# EAGLE design 3d_control (EAGLE 8.3.2)
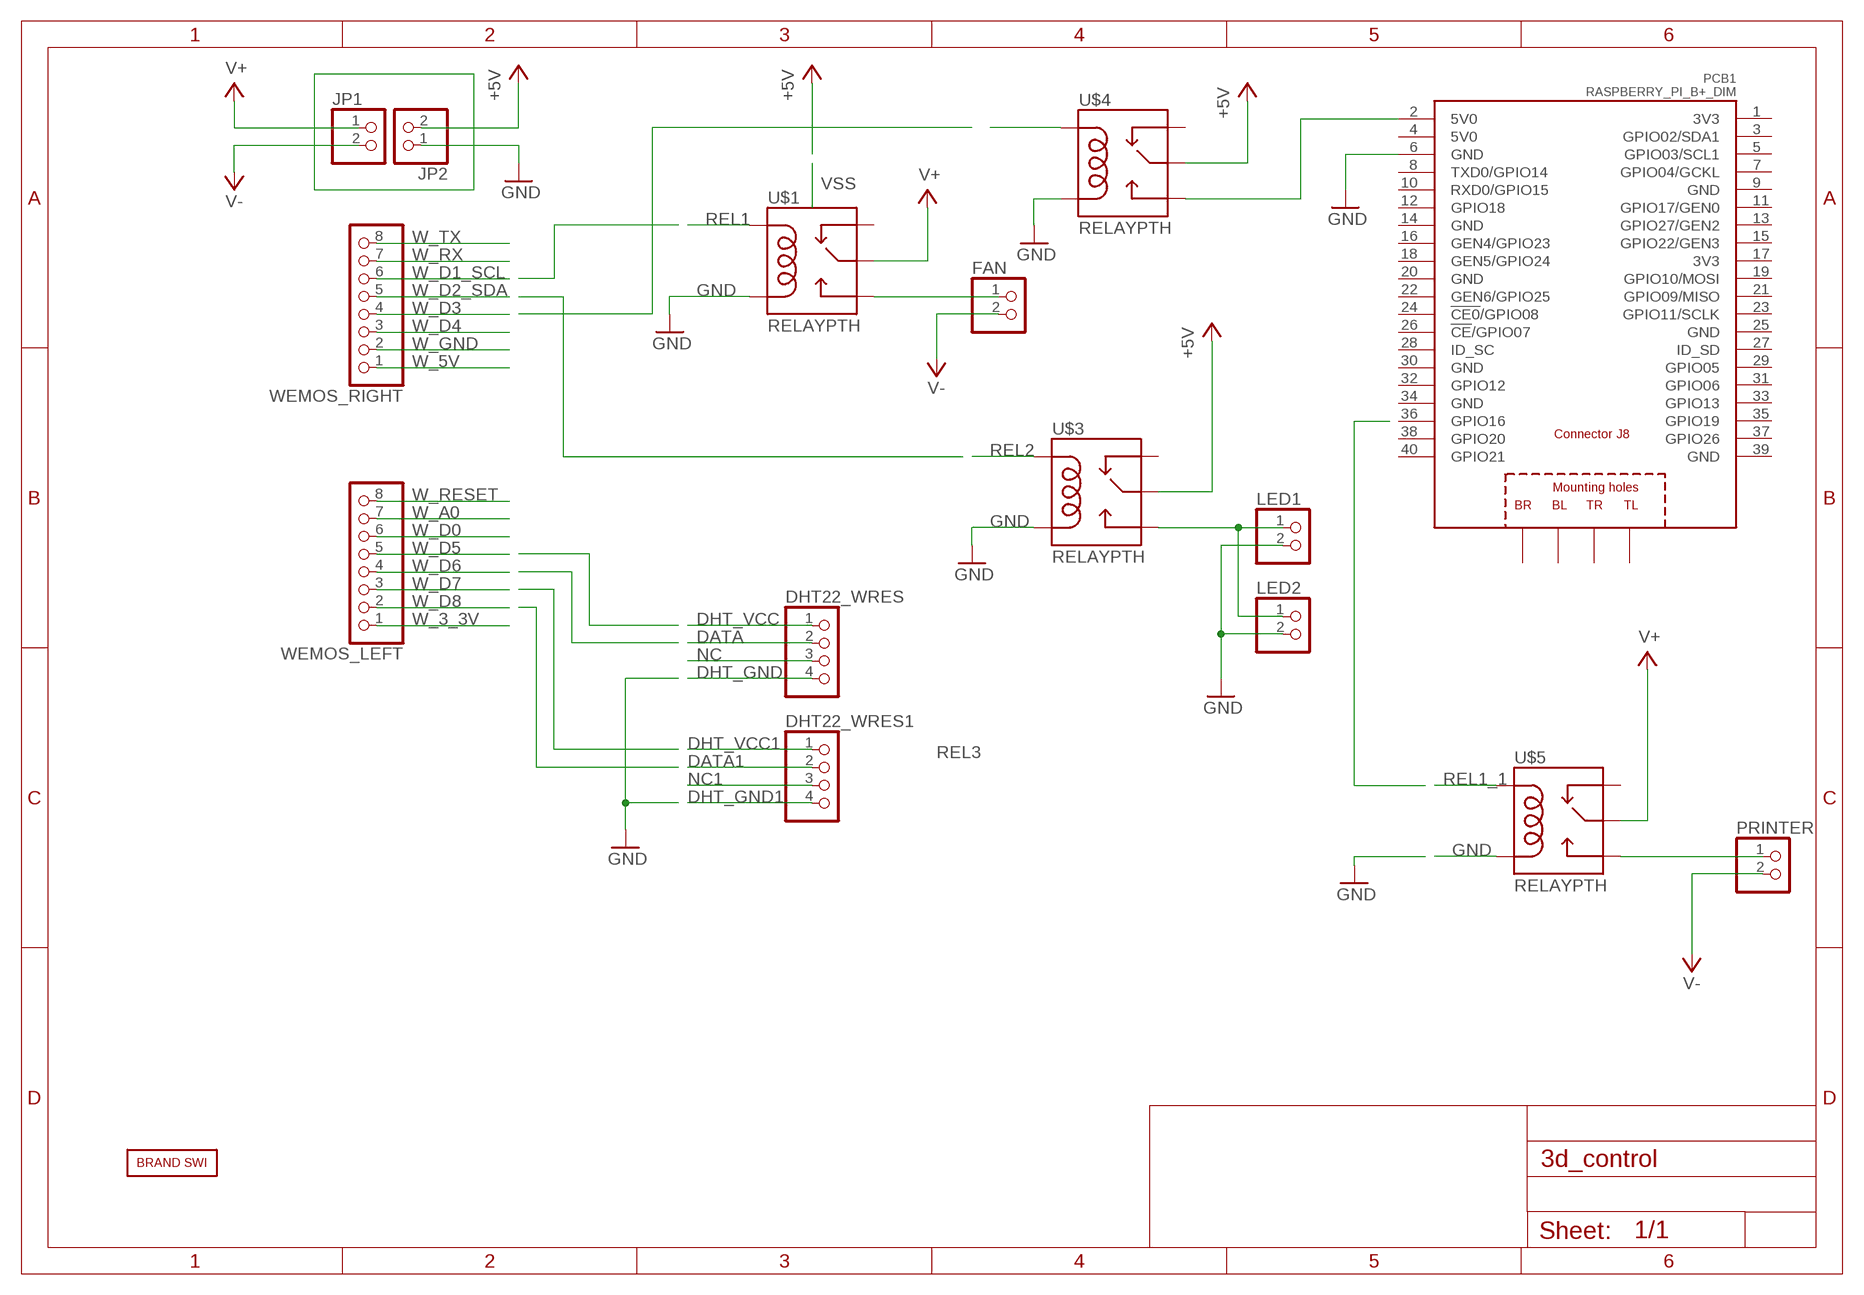
[diagram p0: schematic, sheet 1]

## Parts
DHT22_WRES  PINHD-1X4  [1X04]
DHT22_WRES1  PINHD-1X4  [1X04]
FAN  PINHD-1X2  [1X02]
JP1  PINHD-1X2  [1X02]
JP2  PINHD-1X2  [1X02]
LED1  PINHD-1X2  [1X02]
LED2  PINHD-1X2  [1X02]
PCB1  RASPBERRY_PI_B+_DIM  [RASPBERRY_PI_BPLUS_DIM]
PRINTER  PINHD-1X2  [1X02]
U$1  RELAYPTH  [SRD-05VDC-SL-C]
U$2  BRAND_SWI5X7  [BRAND_SWI_5X7]
U$3  RELAYPTH  [SRD-05VDC-SL-C]
U$4  RELAYPTH  [SRD-05VDC-SL-C]
U$5  RELAYPTH  [SRD-05VDC-SL-C]
WEMOS_LEFT  PINHD-1X8  [1X08]
WEMOS_RIGHT  PINHD-1X8  [1X08]

## Nets
+5V: JP2.2 U$3.SWCOMMON U$4.SWCOMMON
DATA: DHT22_WRES.2
DATA1: DHT22_WRES1.2
DHT_GND: DHT22_WRES.4
DHT_GND1: DHT22_WRES1.4
DHT_VCC: DHT22_WRES.1
DHT_VCC1: DHT22_WRES1.1
GND: JP2.1 LED1.2 LED2.2 PCB1.6(GND) U$1.COIL0 U$3.COIL0 U$4.COIL0 U$5.COIL0
N$1: LED1.1 LED2.1
N$9: FAN.1 U$1.SWOPEN
N$10: PCB1.2(5V0) U$4.SWOPEN
N$13: PRINTER.1 U$5.SWOPEN
NC: DHT22_WRES.3
NC1: DHT22_WRES1.3
REL1: U$1.COIL1
REL1_1: U$5.COIL1
REL2: U$3.COIL1
REL3: U$4.COIL1
V+: JP1.1 U$1.SWCOMMON U$5.SWCOMMON
V-: FAN.2 JP1.2 PRINTER.2
W_3_3V: WEMOS_LEFT.1
W_5V: WEMOS_RIGHT.1
W_A0: WEMOS_LEFT.7
W_D0: WEMOS_LEFT.6
W_D1_SCL: WEMOS_RIGHT.6
W_D2_SDA: WEMOS_RIGHT.5
W_D3: WEMOS_RIGHT.4
W_D4: WEMOS_RIGHT.3
W_D5: WEMOS_LEFT.5
W_D6: WEMOS_LEFT.4
W_D7: WEMOS_LEFT.3
W_D8: WEMOS_LEFT.2
W_GND: WEMOS_RIGHT.2
W_RESET: WEMOS_LEFT.8
W_RX: WEMOS_RIGHT.7
W_TX: WEMOS_RIGHT.8
Unconnected: PCB1.3(GPIO02/SDA1) PCB1.5(GPIO03/SCL1) PCB1.7(GPIO04/GCKL) PCB1.8(TXD0/GPIO14) PCB1.10(RXD0/GPIO15) PCB1.11(GPIO17/GEN0) PCB1.12(GPIO18) PCB1.13(GPIO27/GEN2) PCB1.15(GPIO22/GEN3) PCB1.16(GEN4/GPIO23) PCB1.18(GEN5/GPIO24) PCB1.19(GPIO10/MOSI) PCB1.21(GPIO09/MISO) PCB1.22(GEN6/GPIO25) PCB1.23(GPIO11/SCLK) PCB1.24(!CE0!/GPIO08) PCB1.26(!CE!/GPIO07) PCB1.27(ID_SD) PCB1.28(ID_SC) PCB1.29(GPIO05) PCB1.31(GPIO06) PCB1.32(GPIO12) PCB1.33(GPIO13) PCB1.35(GPIO19) PCB1.36(GPIO16) PCB1.37(GPIO26) PCB1.38(GPIO20) PCB1.40(GPIO21) PCB1.PE_BL(BL) PCB1.PE_BR(BR) PCB1.PE_TL(TL) PCB1.PE_TR(TR) U$1.SWCLOSED(SWCLOSE) U$3.SWCLOSED(SWCLOSE) U$3.SWOPEN U$4.SWCLOSED(SWCLOSE) U$5.SWCLOSED(SWCLOSE)

## Power pins joined to a net without a drawn wire
3V3: PCB1.1(3V3) PCB1.17(3V3)
5V0: PCB1.4(5V0)
GND: PCB1.9(GND) PCB1.14(GND) PCB1.20(GND) PCB1.25(GND) PCB1.30(GND) PCB1.34(GND) PCB1.39(GND)

## Library data of the parts
DHT22_WRES DHT22_WRES1 = pinhead:PINHD-1X4: PIN HEADER
FAN JP1 JP2 LED1 LED2 PRINTER = pinhead:PINHD-1X2: PIN HEADER
PCB1 = SWI_COMMONS:RASPBERRY_PI_B+: Raspberry Pi B+ Basedon issue: Thursday, July 10, 2014 - Rev 1.2 LBR by Tim Rettmann 07-2014
U$1 U$3-U$5 = SWI_COMMONS:RELAY: SPDT relay (COM-00101)
U$2 = BRAND_SWI:BRAND_SWI
WEMOS_LEFT WEMOS_RIGHT = pinhead:PINHD-1X8: PIN HEADER

## Board
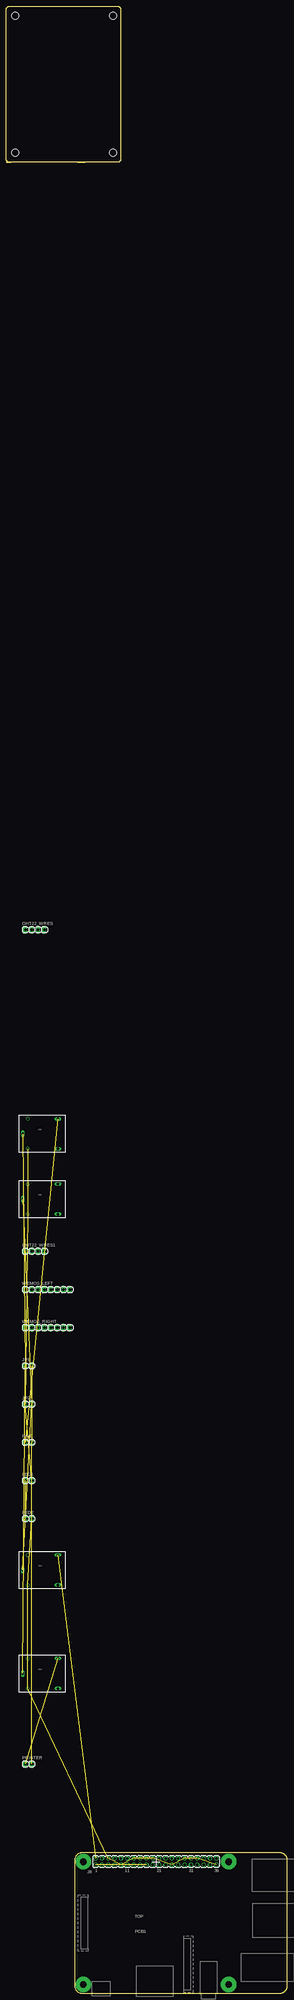
[diagram p1: board, top side]
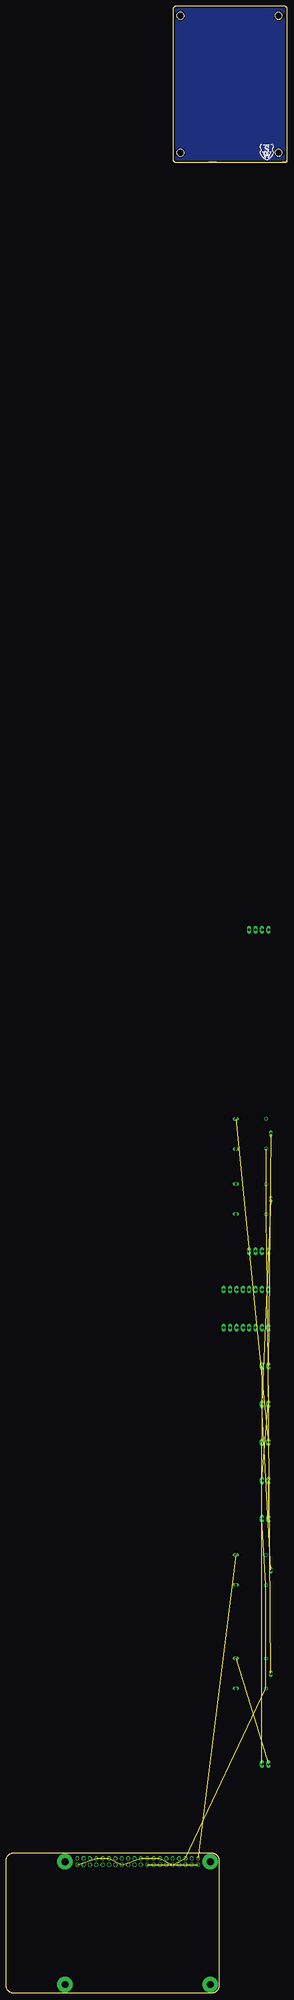
[diagram p2: board, bottom side, seen from below]

Size 112.31 x 792.48 mm. Coordinates in mm from the lower left corner, seen from the top.
Outline: 0,730.25 1.27,730.25
Outline: 1.27,730.25 2.03,730.25
Outline: 28.45,730.25 31.42,730.25
Outline: 1.27,730.25 44.45,730.25 arc90 45.72,731.52 45.72,791.21 arc90 44.45,792.48 1.27,792.48 arc90 0,791.21 0,731.52 arc90 1.27,730.25
Copper layers (1*16): Top 0.035mm / dielectric 1.6mm / Bottom 0.035mm
Design rules "Elecrow_2-layer_PCB_eagle_rule *": minimum track width 12mil, minimum drill 12mil, track to track 6mil, track to pad 6mil, pad to pad 6mil, via to via 8mil, smd to smd 0mil, copper to edge 20mil, drill to drill 10mil, minimum pad ring 6mil, minimum via ring 6mil, stop-mask expansion 0mil, vias tented up to drill 100mil, thermal gap 10mil
Holes 2.8 mm at 3.54,788.67 42.68,788.67 42.68,734.06 3.54,734.06

### Footprints (pad centres in the part's own frame; a part is rotated, then mirrored left to right if it is on the bottom)
1X04 = drill 1.016 long: 1 -3.81,0; 2 -1.27,0; 3 1.27,0; 4 3.81,0
1X02 = drill 1.016 long: 1 -1.27,0; 2 1.27,0
RASPBERRY_PI_BPLUS_DIM = drill 1.016 octagon: 1 8.37,51.23; 2 8.37,53.77; 3 10.91,51.23; 4 10.91,53.77; 5 13.45,51.23; 6 13.45,53.77; 7 15.99,51.23; 8 15.99,53.77; 9 18.53,51.23; 10 18.53,53.77; 11 21.07,51.23; 12 21.07,53.77; 13 23.61,51.23; 14 23.61,53.77; 15 26.15,51.23; 16 26.15,53.77; 17 28.69,51.23; 18 28.69,53.77; 19 31.23,51.23; 20 31.23,53.77; 21 33.77,51.23; 22 33.77,53.77; 23 36.31,51.23; 24 36.31,53.77; 25 38.85,51.23; 26 38.85,53.77; 27 41.39,51.23; 28 41.39,53.77; 29 43.93,51.23; 30 43.93,53.77; 31 46.47,51.23; 32 46.47,53.77; 33 49.01,51.23; 34 49.01,53.77; 35 51.55,51.23; 36 51.55,53.77; 37 54.09,51.23; 38 54.09,53.77; 39 56.63,51.23; 40 56.63,53.77 | drill 2.75 pad 6.2: PE_BL 3.5,3.5; PE_BR 61.5,3.5; PE_TL 3.5,52.5; PE_TR 61.5,52.5
SRD-05VDC-SL-C = drill 0.9: COIL0 -5.39,-6.12; COIL1 -5.39,5.88 | drill 0.9 long: SWCLOSED 6.61,-6.12; SWCOMMON -7.39,-0.12; SWOPEN 6.61,5.88
1X08 = drill 1.016 long: 1 -8.89,0; 2 -6.35,0; 3 -3.81,0; 4 -1.27,0; 5 1.27,0; 6 3.81,0; 7 6.35,0; 8 8.89,0

### Placement (x,y rotation side)
DHT22_WRES  11.43,424.18 0 top
DHT22_WRES1  11.43,295.91 0 top
FAN  8.89,219.71 0 top
JP1  8.89,250.19 0 top
JP2  8.89,234.95 0 top
LED1  8.89,204.47 0 top
LED2  8.89,189.23 0 top
PCB1  27.3,0 0 top
PRINTER  8.89,91.44 0 top
U$1  13.97,342.9 0 top
U$2  11.3,730.88 0 bottom
U$3  13.97,316.87 0 top
U$4  13.97,168.91 0 top
U$5  13.97,127.63 0 top
WEMOS_LEFT  16.51,280.67 0 top
WEMOS_RIGHT  16.51,265.43 0 top

### Tracks (layer width: path | path; a pad name or v marks a point on that pad's centre or on a via)
3V3  (1 unrouted)
+5V  (2 unrouted)
DGND
  pour Bottom (isolate 0.61): 0,789.94 arc-90 2.54,792.48 3.81,792.48 43.18,792.48 arc-90 45.72,789.94 45.72,732.79 arc-90 43.18,730.25 41.91,730.25 1.27,730.25 arc-90 0,731.52 0,732.79
GND  (14 unrouted)
N$1  (1 unrouted)
N$9  (1 unrouted)
N$10  (1 unrouted)
N$13  (1 unrouted)
V+  (2 unrouted)
V-  (2 unrouted)

### Text on the board
bRestrict: PN39022R1B1 | WSHIELD_MCP_BASIC